# EAGLE design cryobondr-qbit2-aqc (EAGLE 6.1)
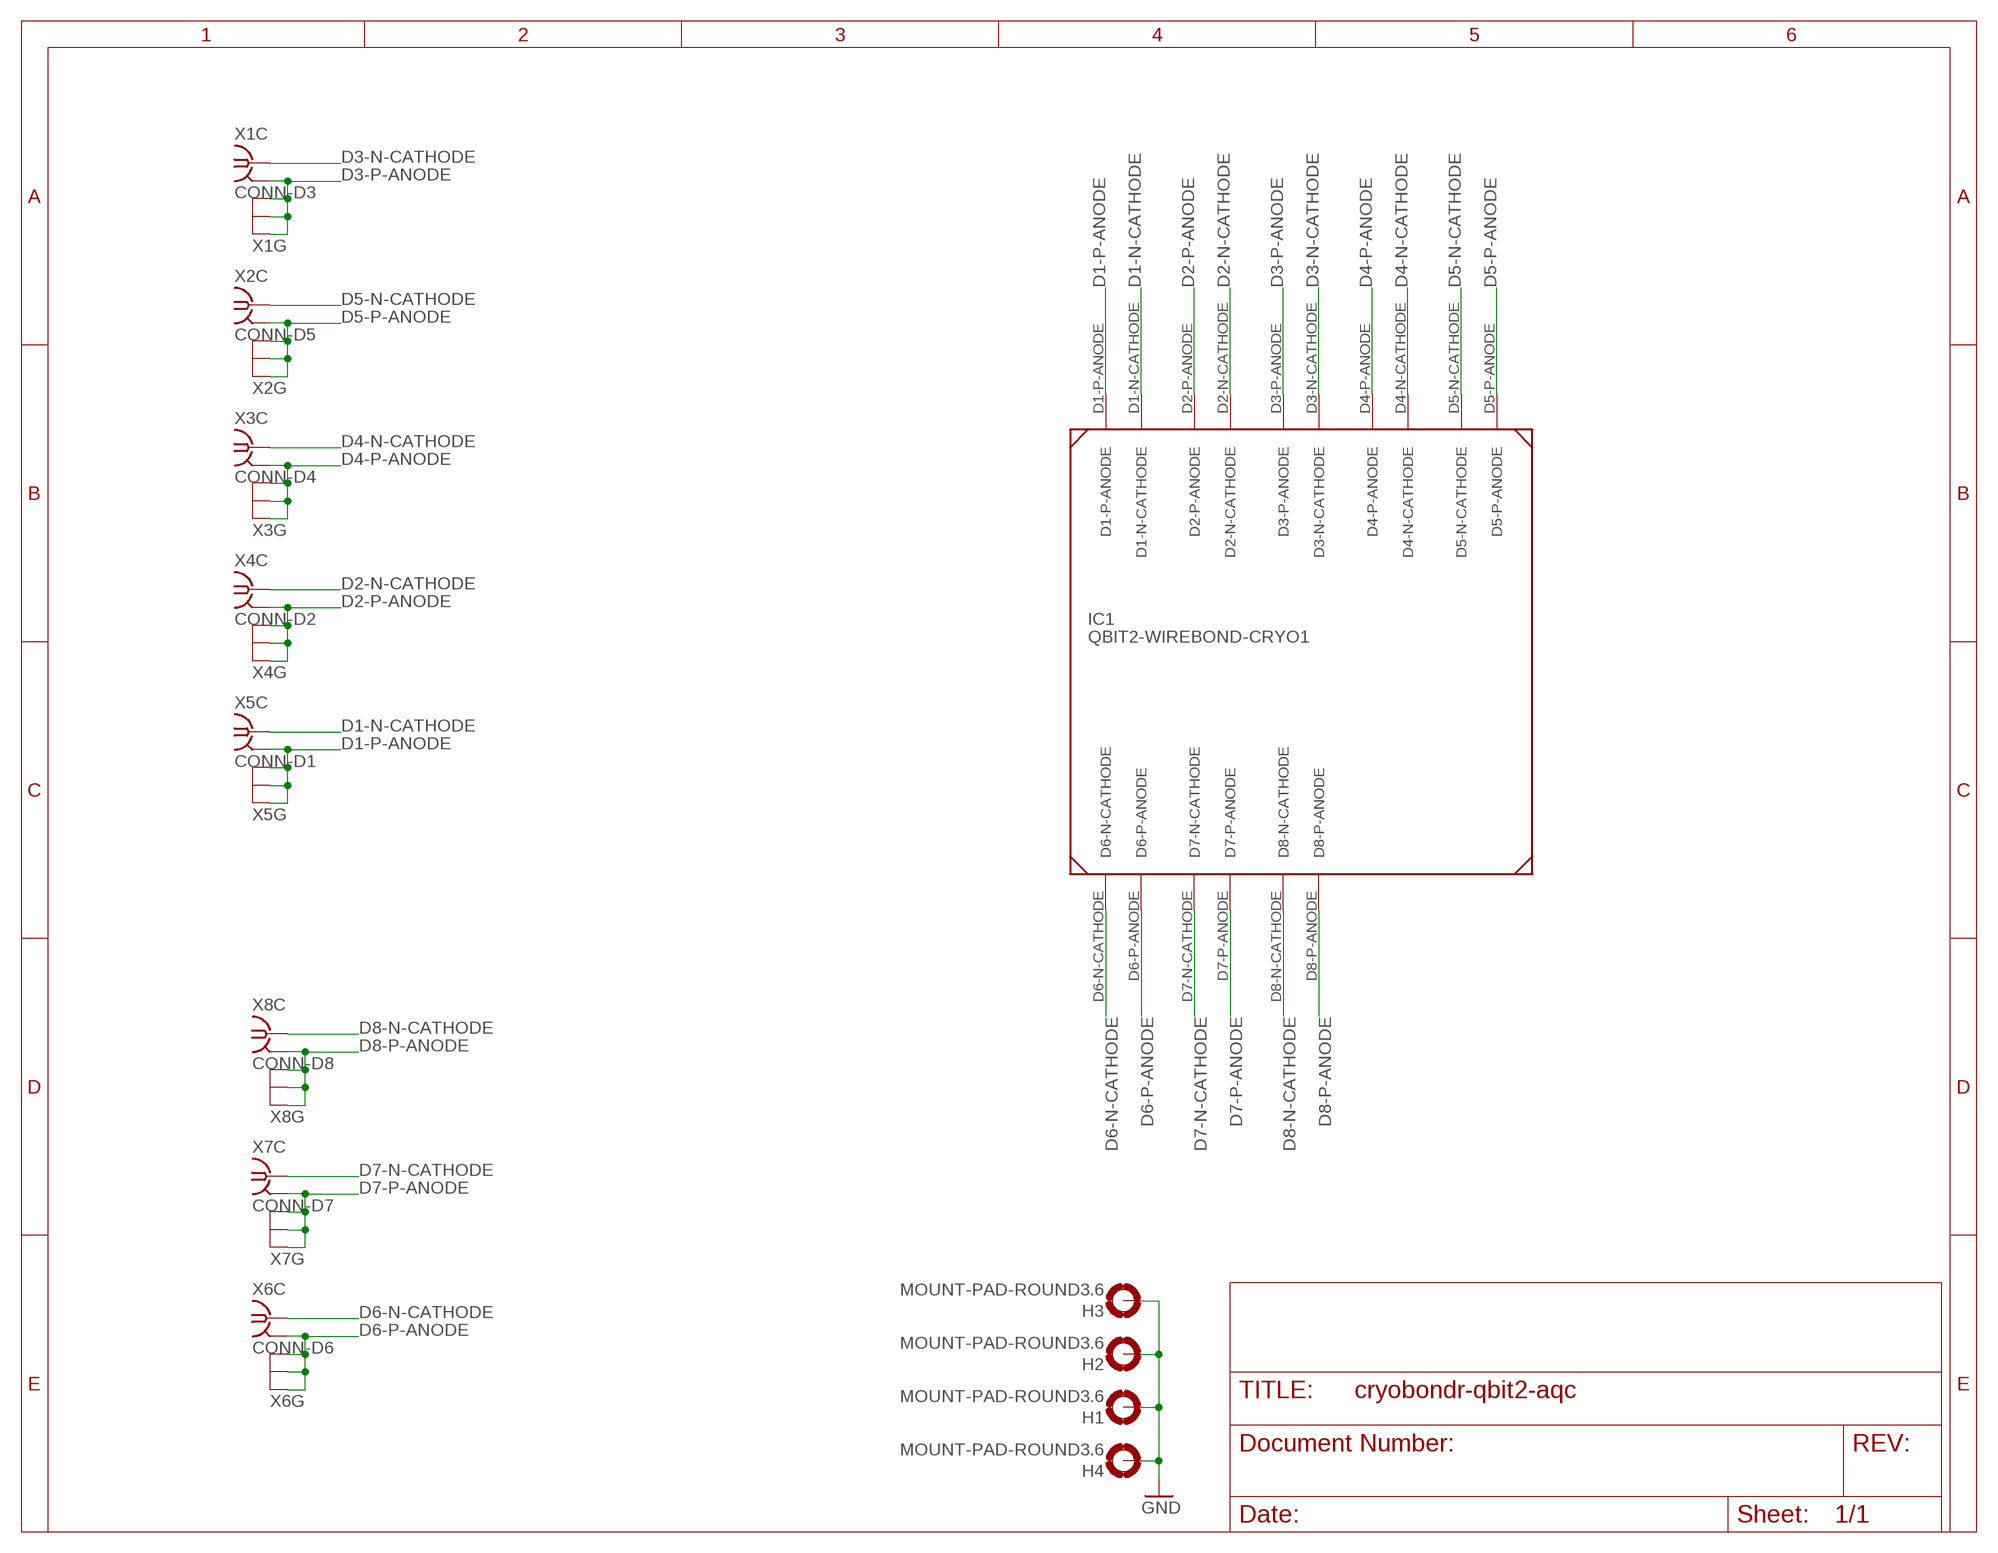
[diagram p0: schematic, sheet 1]

## Parts
H1  MOUNT-PAD-ROUND3.6  [3,6-PAD]
H2  MOUNT-PAD-ROUND3.6  [3,6-PAD]
H3  MOUNT-PAD-ROUND3.6  [3,6-PAD]
H4  MOUNT-PAD-ROUND3.6  [3,6-PAD]
IC1  QBIT2-WIREBOND-CRYO1  [QBIT2-WIREBOND-CRYO1]
X1  CONN-D3  MMCX  [MMCX-SMT]
X2  CONN-D5  MMCX  [MMCX-SMT]
X3  CONN-D4  MMCX  [MMCX-SMT]
X4  CONN-D2  MMCX  [MMCX-SMT]
X5  CONN-D1  MMCX  [MMCX-SMT]
X6  CONN-D6  MMCX  [MMCX-SMT]
X7  CONN-D7  MMCX  [MMCX-SMT]
X8  CONN-D8  MMCX  [MMCX-SMT]

## Nets
D1-N-CATHODE: IC1.D1-N-CATHODE X5.S
D1-P-ANODE: IC1.D1-P-ANODE X5.G1(C:GND) X5.G2(G:GND) X5.G3(G:GND) X5.G4(G:GND)
D2-N-CATHODE: IC1.D2-N-CATHODE X4.S
D2-P-ANODE: IC1.D2-P-ANODE X4.G1(C:GND) X4.G2(G:GND) X4.G3(G:GND) X4.G4(G:GND)
D3-N-CATHODE: IC1.D3-N-CATHODE X1.S
D3-P-ANODE: IC1.D3-P-ANODE X1.G1(C:GND) X1.G2(G:GND) X1.G3(G:GND) X1.G4(G:GND)
D4-N-CATHODE: IC1.D4-N-CATHODE X3.S
D4-P-ANODE: IC1.D4-P-ANODE X3.G1(C:GND) X3.G2(G:GND) X3.G3(G:GND) X3.G4(G:GND)
D5-N-CATHODE: IC1.D5-N-CATHODE X2.S
D5-P-ANODE: IC1.D5-P-ANODE X2.G1(C:GND) X2.G2(G:GND) X2.G3(G:GND) X2.G4(G:GND)
D6-N-CATHODE: IC1.D6-N-CATHODE X6.S
D6-P-ANODE: IC1.D6-P-ANODE X6.G1(C:GND) X6.G2(G:GND) X6.G3(G:GND) X6.G4(G:GND)
D7-N-CATHODE: IC1.D7-N-CATHODE X7.S
D7-P-ANODE: IC1.D7-P-ANODE X7.G1(C:GND) X7.G2(G:GND) X7.G3(G:GND) X7.G4(G:GND)
D8-N-CATHODE: IC1.D8-N-CATHODE X8.S
D8-P-ANODE: IC1.D8-P-ANODE X8.G1(C:GND) X8.G2(G:GND) X8.G3(G:GND) X8.G4(G:GND)
GND: H1.B3,6(MOUNT) H2.B3,6(MOUNT) H3.B3,6(MOUNT) H4.B3,6(MOUNT)

## Library data of the parts
H1-H4 = holes:MOUNT-PAD-ROUND: MOUNTING PAD, round
IC1 = meng:QBIT2-WIREBOND-CRYO1
X1-X8 = meng:MMCX

## Board
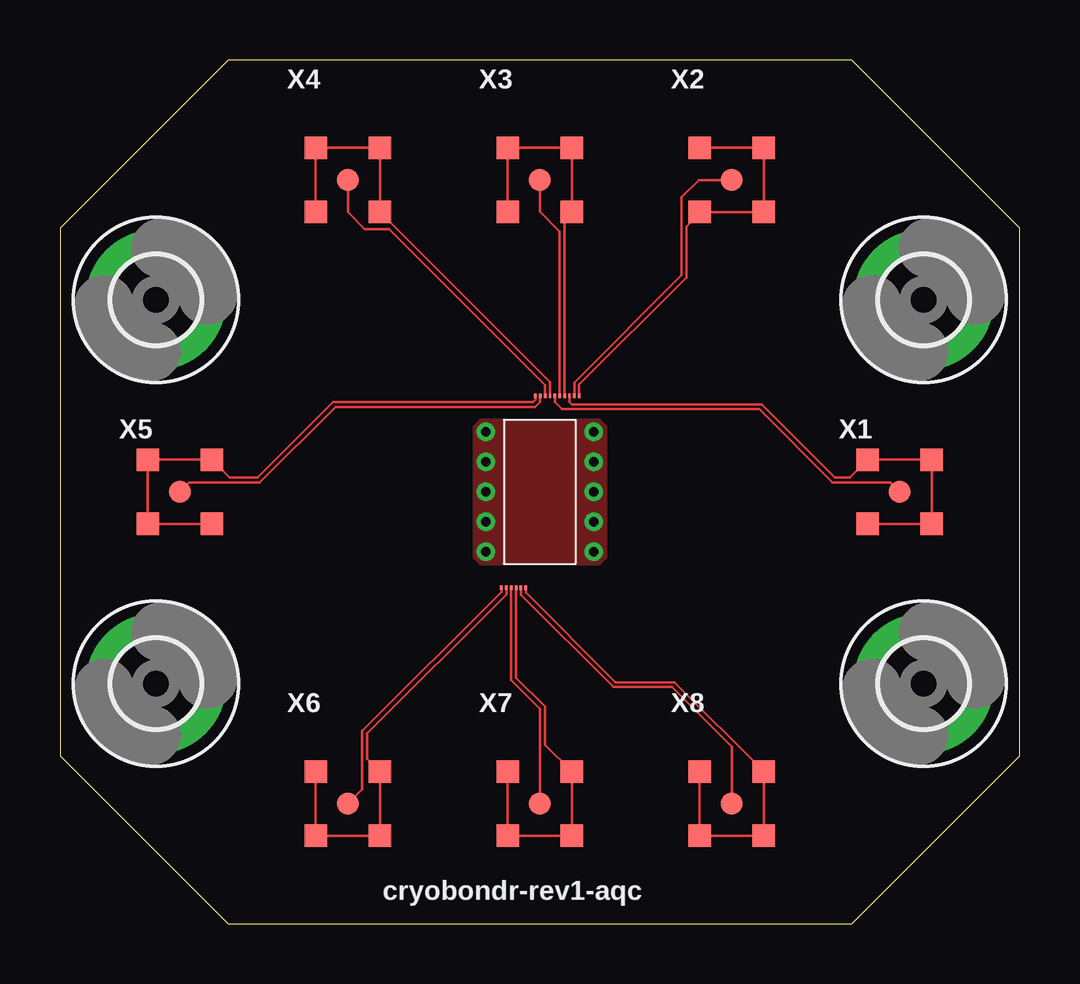
[diagram p1: board, top side]
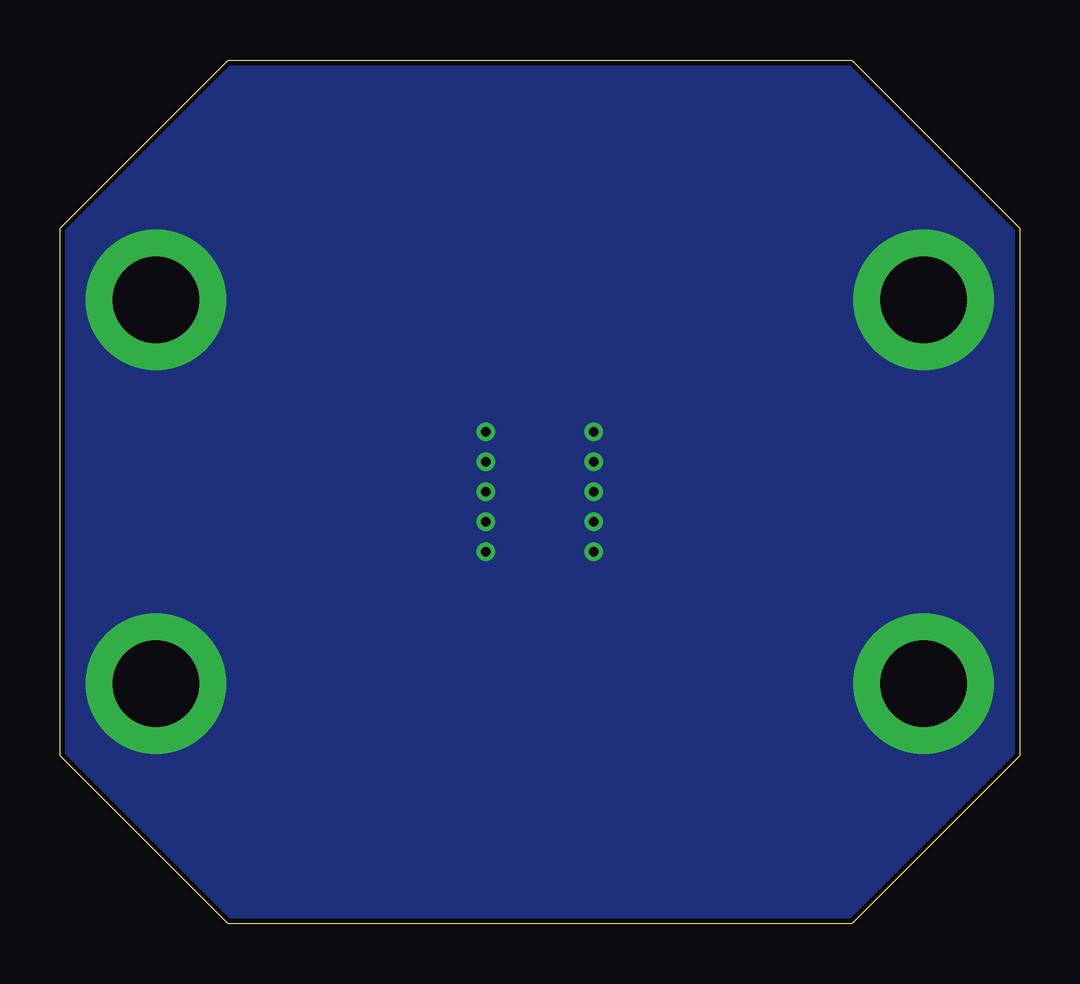
[diagram p2: board, bottom side, seen from below]

Size 40 x 36 mm. Coordinates in mm from the lower left corner, seen from the top.
Outline: 7,0 33,0 40,7 40,29 33,36 7,36 0,29 0,7 7,0
Copper layers (1*16): Top 0.035mm / dielectric 1.5mm / Bottom 0.035mm
Design rules: minimum track width 4mil, minimum drill 15mil, track to track 4mil, track to pad 4mil, pad to pad 4mil, via to via 4mil, smd to smd 4mil, copper to edge 8mil, drill to drill 8mil, minimum pad ring 10mil, minimum via ring 8mil, stop-mask expansion 4mil, vias tented up to drill 0mil, thermal gap 10mil

### Footprints (pad centres in the part's own frame; a part is rotated, then mirrored left to right if it is on the bottom)
3,6-PAD = drill 3.6 pad 5.842: B3,6 0,0
QBIT2-WIREBOND-CRYO1 = smd 0.102 x 0.203: D1-N-CATHODE 0.02,4; D1-P-ANODE -0.183,4; D2-N-CATHODE 0.223,4; D2-P-ANODE 0.426,4; D3-N-CATHODE 0.63,4; D3-P-ANODE 1.239,4; D4-N-CATHODE 0.833,4; D4-P-ANODE 1.036,4; D5-N-CATHODE 1.442,4; D5-P-ANODE 1.646,4; D6-N-CATHODE -1.598,-4; D6-P-ANODE -1.394,-4; D7-N-CATHODE -1.191,-4; D7-P-ANODE -0.988,-4; D8-N-CATHODE -0.785,-4; D8-P-ANODE -0.582,-4
MMCX-SMT = smd 0.94 x 0.94: G1 -1.333,1.333; G2 1.333,1.333; G3 1.333,-1.333; G4 -1.333,-1.333 | smd 0.889 x 0.889: S 0,0

### Placement (x,y rotation side)
H1  36,10 0 top
H2  4,10 0 top
H3  36,26 0 top
H4  4,26 0 top
IC1  20,18 0 top
X1  35,18 0 top
X2  28,31 0 top
X3  20,31 0 top
X4  12,31 0 top
X5  5,18 0 top
X6  12,5 0 top
X7  20,5 0 top
X8  28,5 0 top

### Tracks (layer width: path | path; a pad name or v marks a point on that pad's centre or on a via)
D1-N-CATHODE
  Top 0.102: IC1.D1-N-CATHODE 20.02,21.75 19.81,21.54 11.48,21.54 8.33,18.39 5.39,18.39 X5.S
D1-P-ANODE
  Top 0.102: X5.G3 X5.G4 X5.G1 X5.G2 7.07,18.59 8.23,18.59 11.38,21.74 19.71,21.74 19.82,21.85 IC1.D1-P-ANODE
D2-N-CATHODE
  Top 0.102: IC1.D2-N-CATHODE 20.22,22.45 13.72,28.96 12.7,28.96 12,29.66 X4.S
D2-P-ANODE
  Top 0.102: IC1.D2-P-ANODE 20.43,22.57 X4.G3 X4.G2 X4.G1 X4.G4
D3-N-CATHODE
  Top 0.102: IC1.D3-N-CATHODE 20.63,21.74 20.93,21.44 29.16,21.44 32.21,18.39 34.61,18.39 X1.S
D3-P-ANODE
  Top 0.102: IC1.D3-P-ANODE 21.24,21.74 21.34,21.64 29.26,21.64 32.31,18.59 32.93,18.59 X1.G1 X1.G2 X1.G3 X1.G4
D4-N-CATHODE
  Top 0.102: IC1.D4-N-CATHODE 20.83,28.84 20,29.68 X3.S
D4-P-ANODE
  Top 0.102: IC1.D4-P-ANODE 21.04,29.37 X3.G3 X3.G2 X3.G1 X3.G4
D5-N-CATHODE
  Top 0.102: IC1.D5-N-CATHODE 21.44,22.56 25.91,27.03 25.91,30.28 26.63,31 X2.S
D5-P-ANODE
  Top 0.102: IC1.D5-P-ANODE 21.65,22.46 26.11,26.92 26.11,29.06 26.67,29.61 X2.G4 X2.G3 X2.G2 X2.G1
D6-N-CATHODE
  Top 0.102: IC1.D6-N-CATHODE 18.4,13.83 12.6,8.03 12.6,5.6 X6.S
D6-P-ANODE
  Top 0.102: IC1.D6-P-ANODE 18.61,13.73 12.8,7.92 12.8,6.87 X6.G2 X6.G3 X6.G4 X6.G1
D7-N-CATHODE
  Top 0.102: X7.S 20,8.96 18.81,10.15 IC1.D7-N-CATHODE
D7-P-ANODE
  Top 0.102: IC1.D7-P-ANODE 19.01,10.25 20.22,9.04 20.22,7.45 X7.G2 X7.G3 X7.G4 X7.G1
D8-N-CATHODE
  Top 0.102: IC1.D8-N-CATHODE 19.21,13.7 23.06,9.86 25.5,9.86 28,7.36 X8.S
D8-P-ANODE
  Top 0.102: IC1.D8-P-ANODE 19.42,13.8 23.16,10.06 25.61,10.06 X8.G2 X8.G3 X8.G4 X8.G1
GND  (via drill 0.38)
  other vias: 17.75,20.5 17.75,19.25 17.75,18 17.75,16.75 17.75,15.5 22.25,20.5 22.25,19.25 22.25,18 22.25,16.75 22.25,15.5
  pour Bottom (no thermals): 0,0 40,0 40,36 0,36
  pour Top: 17.25,15.25 17.5,15 22.5,15 22.75,15.25 22.75,20.75 22.5,21 17.5,21 17.25,20.75

### Text on the board
tPlace: cryobondr-rev1-aqc